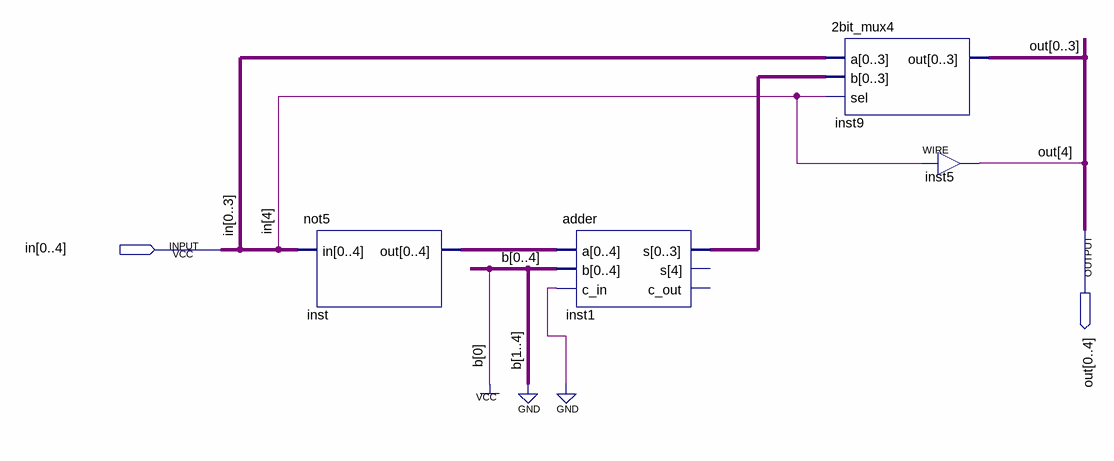
[diagram p0: schematic sheet]
// Quartus schematic 2complement.bdf as structural Verilog: 4 symbols, 2 pins
module \2complement  (
  input  [0:4] in,
  output [0:4] out
);

  wire [3:0] inst1_s;
  wire [4:0] inst_out;
  wire [4:0] inst1_s_open;  // unused outputs

  not5 inst (.in(in), .out(inst_out));
  adder inst1 (
    .a(inst_out), .b(5'b10000), .c_in(1'b0),
    .s({inst1_s_open[4], inst1_s[0], inst1_s[1], inst1_s[2], inst1_s[3]}));  // open: c_out
  \2bit_mux4  inst9 (.a(in[0:3]), .b(inst1_s), .sel(in[4]), .out(out[0:3]));
  assign out[4] = in[4];  // WIRE inst5
endmodule
